# EAGLE design 6ch-dimmer (EAGLE 6.4)
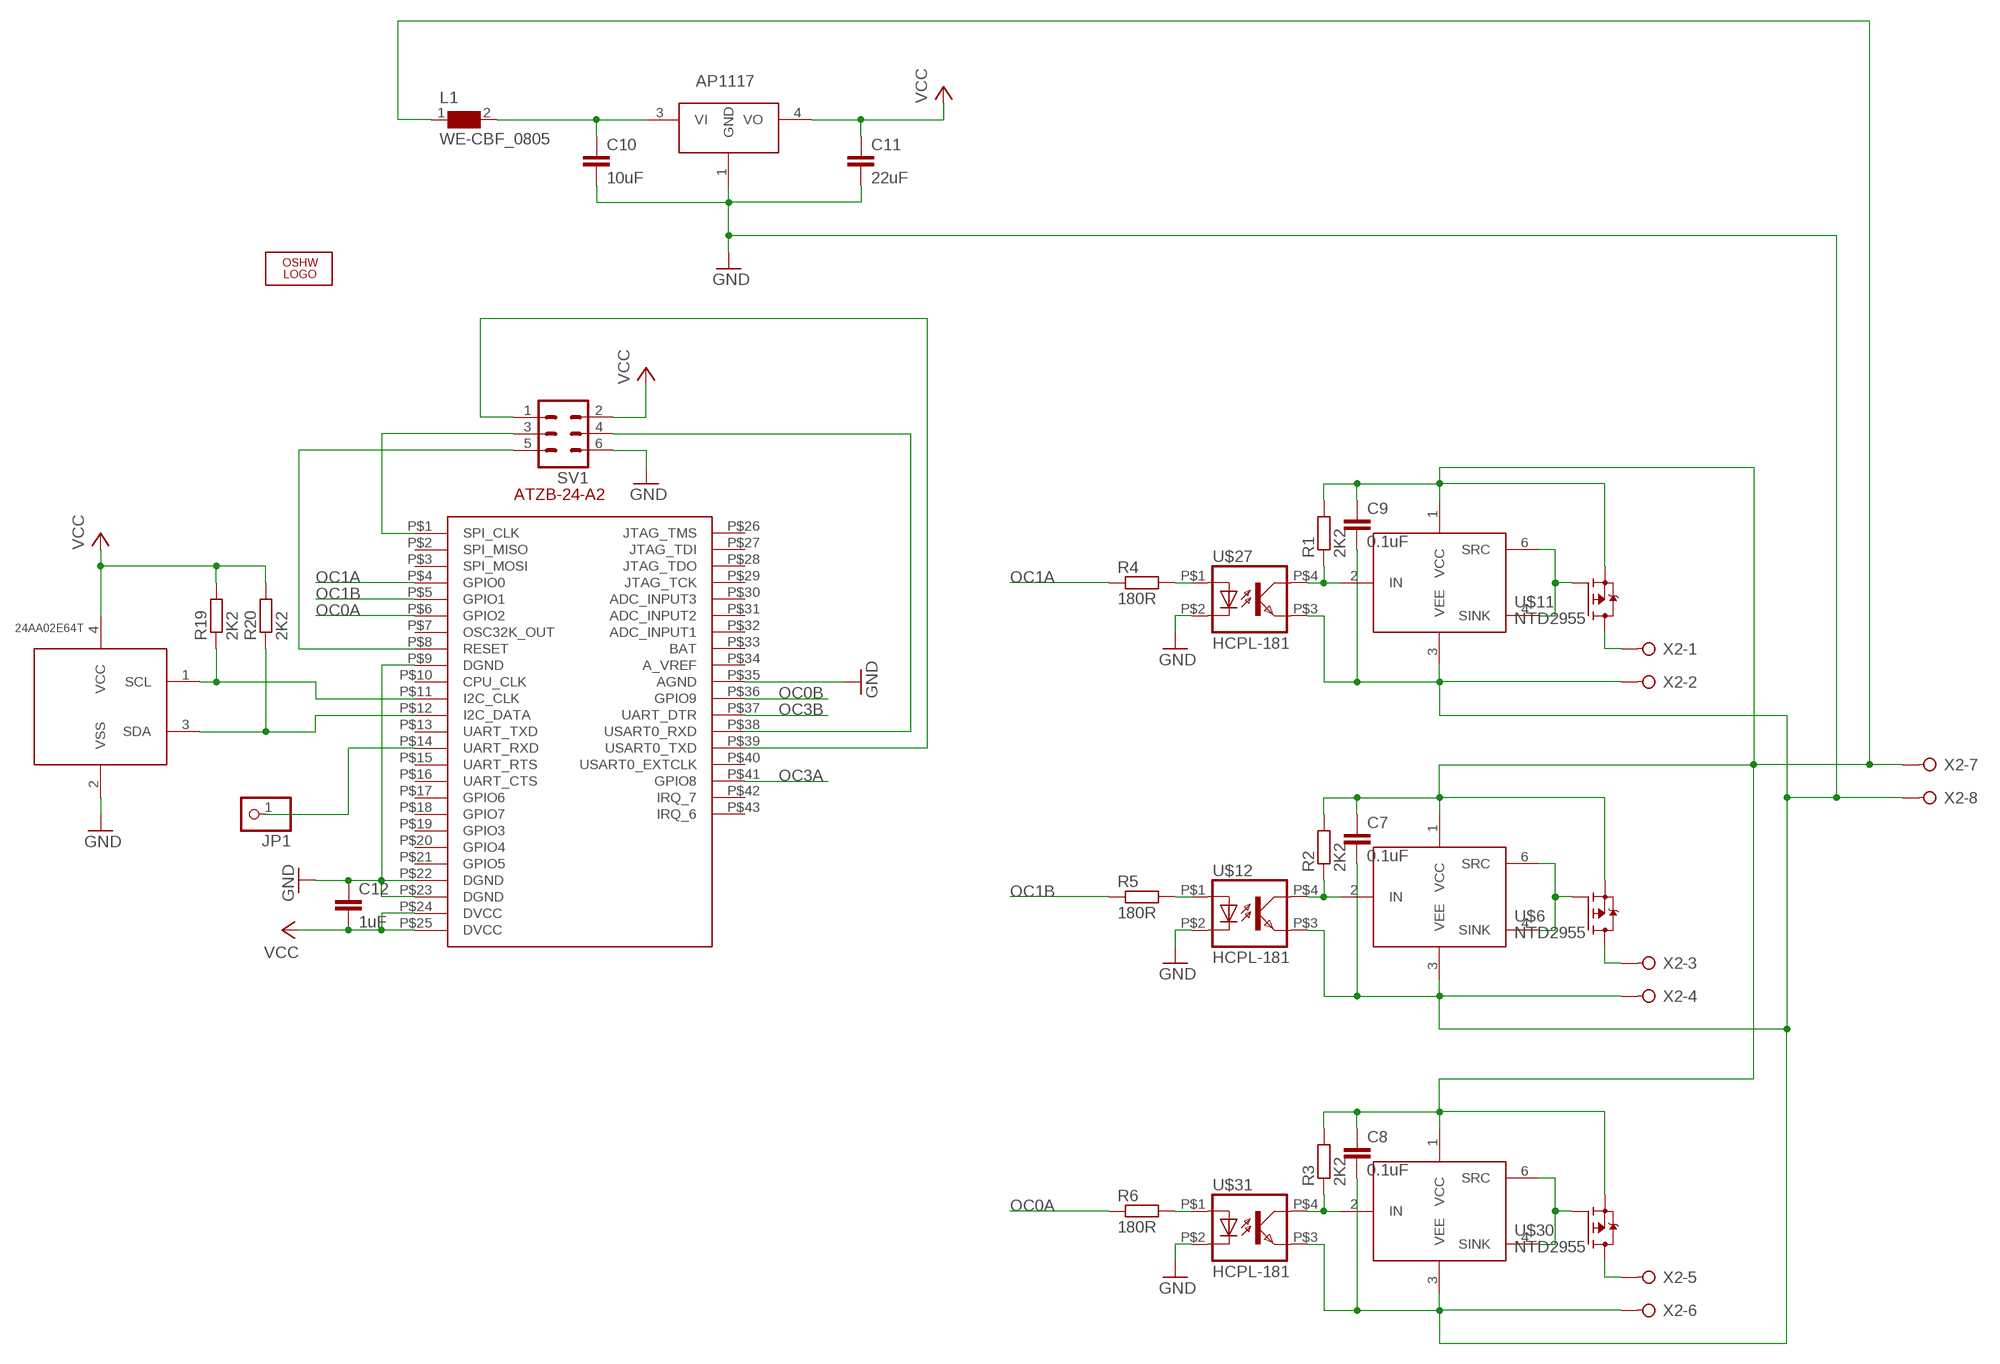
[diagram p0: schematic, sheet 1, part 1 of 2]
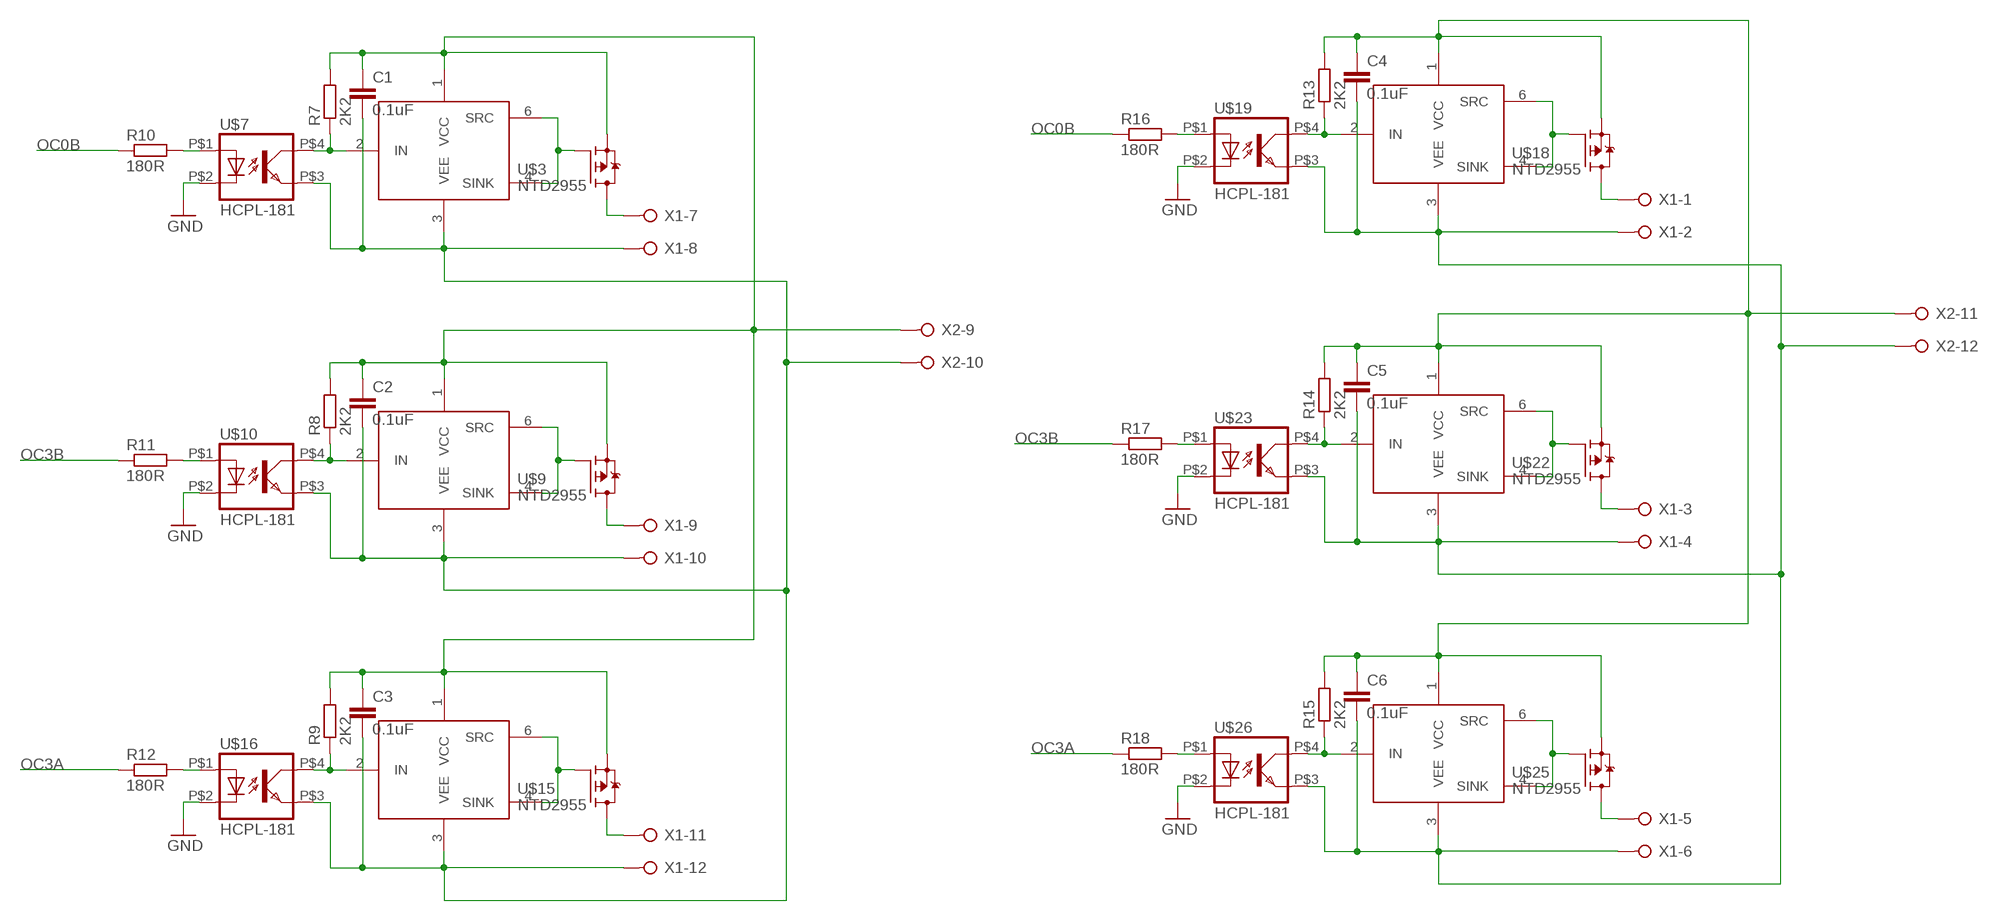
[diagram p1: schematic, sheet 1, part 2 of 2]

## Parts
C1  0.1uF  C-EUC0603  [C0603]
C2  0.1uF  C-EUC0603  [C0603]
C3  0.1uF  C-EUC0603  [C0603]
C4  0.1uF  C-EUC0603  [C0603]
C5  0.1uF  C-EUC0603  [C0603]
C6  0.1uF  C-EUC0603  [C0603]
C7  0.1uF  C-EUC0603  [C0603]
C8  0.1uF  C-EUC0603  [C0603]
C9  0.1uF  C-EUC0603  [C0603]
C10  10uF  C-EUC1210  [C1210]
C11  22uF  C-EUC1210  [C1210]
C12  1uF  C-EUC0603  [C0603]
JP1  PINHD-1X1  [1X01]
L1  WE-CBF_0805  [0805]
LOGO1  OSHW_LOGO_10MILX0500-NT  [OSHW_10X500_NOTEXT]
R1  2K2  R-EU_R0603  [R0603]
R2  2K2  R-EU_R0603  [R0603]
R3  2K2  R-EU_R0603  [R0603]
R4  180R  R-EU_R0603  [R0603]
R5  180R  R-EU_R0603  [R0603]
R6  180R  R-EU_R0603  [R0603]
R7  2K2  R-EU_R0603  [R0603]
R8  2K2  R-EU_R0603  [R0603]
R9  2K2  R-EU_R0603  [R0603]
R10  180R  R-EU_R0603  [R0603]
R11  180R  R-EU_R0603  [R0603]
R12  180R  R-EU_R0603  [R0603]
R13  2K2  R-EU_R0603  [R0603]
R14  2K2  R-EU_R0603  [R0603]
R15  2K2  R-EU_R0603  [R0603]
R16  180R  R-EU_R0603  [R0603]
R17  180R  R-EU_R0603  [R0603]
R18  180R  R-EU_R0603  [R0603]
R19  2K2  R-EU_R0603  [R0603]
R20  2K2  R-EU_R0603  [R0603]
SV1  MA03-2  [MA03-2]
U$1  ATZB-24-A2  [ATZB-24-A2]
U$2  ZXGD3005E6  [SOT23-6]
U$3  NTD2955  [DPAK]
U$4  ZXGD3005E6  [SOT23-6]
U$5  ZXGD3005E6  [SOT23-6]
U$6  NTD2955  [DPAK]
U$7  HCPL-181  [HCPL-181]
U$8  ZXGD3005E6  [SOT23-6]
U$9  NTD2955  [DPAK]
U$10  HCPL-181  [HCPL-181]
U$11  NTD2955  [DPAK]
U$12  HCPL-181  [HCPL-181]
U$13  ZXGD3005E6  [SOT23-6]
U$14  ZXGD3005E6  [SOT23-6]
U$15  NTD2955  [DPAK]
U$16  HCPL-181  [HCPL-181]
U$17  ZXGD3005E6  [SOT23-6]
U$18  NTD2955  [DPAK]
U$19  HCPL-181  [HCPL-181]
U$20  24AA02E64T  [SOT23-5L]
U$21  ZXGD3005E6  [SOT23-6]
U$22  NTD2955  [DPAK]
U$23  HCPL-181  [HCPL-181]
U$24  ZXGD3005E6  [SOT23-6]
U$25  NTD2955  [DPAK]
U$26  HCPL-181  [HCPL-181]
U$27  HCPL-181  [HCPL-181]
U$28  AP1117  [SOT223]
U$30  NTD2955  [DPAK]
U$31  HCPL-181  [HCPL-181]
X1  W237-12P  [W237-12P]
X2  W237-12P  [W237-12P]

## Nets
GND: C7.2 C8.2 C9.2 C10.2 C11.2 C12.1 SV1.6 U$1.P$9(DGND) U$1.P$22(DGND) U$1.P$23(DGND) U$1.P$35(AGND) U$4.3(VEE) U$5.3(VEE) U$7.P$2(C) U$10.P$2(C) U$12.P$2(C) U$12.P$3(EMIT) U$13.3(VEE) U$16.P$2(C) U$19.P$2(C) U$20.2(VSS) U$23.P$2(C) U$26.P$2(C) U$27.P$2(C) U$27.P$3(EMIT) U$28.1(GND) U$31.P$2(C) U$31.P$3(EMIT) X2.2 X2.4 X2.6 X2.8
N$1: U$2.4(SINK) U$2.6(SRC) U$3.1(G)
N$2: R7.1 U$2.2(IN) U$7.P$4(COL)
N$3: U$3.4(D) X1.7
N$4: U$4.4(SINK) U$4.6(SRC) U$11.1(G)
N$5: U$5.4(SINK) U$5.6(SRC) U$6.1(G)
N$6: R2.1 U$5.2(IN) U$12.P$4(COL)
N$7: U$8.4(SINK) U$8.6(SRC) U$9.1(G)
N$8: R8.1 U$8.2(IN) U$10.P$4(COL)
N$9: U$9.4(D) X1.9
N$10: U$14.4(SINK) U$14.6(SRC) U$15.1(G)
N$11: R9.1 U$14.2(IN) U$16.P$4(COL)
N$12: C1.1 C2.1 C3.1 R7.2 R8.2 R9.2 U$2.1(VCC) U$3.3(S) U$8.1(VCC) U$9.3(S) U$14.1(VCC) U$15.3(S) X2.9
N$13: R1.1 U$4.2(IN) U$27.P$4(COL)
N$14: U$11.4(D) X2.1
N$15: U$15.4(D) X1.11
N$16: R10.2 U$7.P$1(A)
N$17: R11.2 U$10.P$1(A)
N$18: R12.2 U$16.P$1(A)
N$20: JP1.1 U$1.P$14(UART_RXD)
N$22: U$6.4(D) X2.3
N$23: U$13.4(SINK) U$13.6(SRC) U$30.1(G)
N$24: R3.1 U$13.2(IN) U$31.P$4(COL)
N$25: C1.2 C2.2 C3.2 U$2.3(VEE) U$7.P$3(EMIT) U$8.3(VEE) U$10.P$3(EMIT) U$14.3(VEE) U$16.P$3(EMIT) X1.8 X1.10 X1.12 X2.10
N$26: C7.1 C8.1 C9.1 L1.1 R1.2 R2.2 R3.2 U$4.1(VCC) U$5.1(VCC) U$6.3(S) U$11.3(S) U$13.1(VCC) U$30.3(S) X2.7
N$27: U$17.4(SINK) U$17.6(SRC) U$18.1(G)
N$29: U$30.4(D) X2.5
N$30: R13.1 U$17.2(IN) U$19.P$4(COL)
N$31: U$18.4(D) X1.1
N$32: R4.2 U$27.P$1(A)
N$33: U$21.4(SINK) U$21.6(SRC) U$22.1(G)
N$34: R5.2 U$12.P$1(A)
N$35: R6.2 U$31.P$1(A)
N$36: R14.1 U$21.2(IN) U$23.P$4(COL)
N$37: U$22.4(D) X1.3
N$38: U$24.4(SINK) U$24.6(SRC) U$25.1(G)
N$39: R15.1 U$24.2(IN) U$26.P$4(COL)
N$40: C4.1 C5.1 C6.1 R13.2 R14.2 R15.2 U$17.1(VCC) U$18.3(S) U$21.1(VCC) U$22.3(S) U$24.1(VCC) U$25.3(S) X2.11
N$41: U$25.4(D) X1.5
N$42: R16.2 U$19.P$1(A)
N$43: R17.2 U$23.P$1(A)
N$44: R18.2 U$26.P$1(A)
N$45: C4.2 C5.2 C6.2 U$17.3(VEE) U$19.P$3(EMIT) U$21.3(VEE) U$23.P$3(EMIT) U$24.3(VEE) U$26.P$3(EMIT) X1.2 X1.4 X1.6 X2.12
N$51: R19.1 U$1.P$11(I2C_CLK) U$20.1(SCL)
N$52: R20.1 U$1.P$12(I2C_DATA) U$20.3(SDA)
N$53: C10.1 L1.2 U$28.3(VI)
N$54: SV1.1 U$1.P$39(USART0_TXD)
N$55: SV1.4 U$1.P$38(USART0_RXD)
N$56: SV1.3 U$1.P$1(SPI_CLK)
N$57: SV1.5 U$1.P$8(RESET)
OC0A: R6.1 U$1.P$6(GPIO2)
OC0B: R10.1 R16.1 U$1.P$36(GPIO9)
OC1A: R4.1 U$1.P$4(GPIO0)
OC1B: R5.1 U$1.P$5(GPIO1)
OC3A: R12.1 R18.1 U$1.P$41(GPIO8)
OC3B: R11.1 R17.1 U$1.P$37(UART_DTR)
VCC: C11.1 C12.2 R19.2 R20.2 SV1.2 U$1.P$24(DVCC) U$1.P$25(DVCC) U$20.4(VCC) U$28.4(VO)
Unconnected: U$1.P$2(SPI_MISO) U$1.P$3(SPI_MOSI) U$1.P$7(OSC32K_OUT) U$1.P$10(CPU_CLK) U$1.P$13(UART_TXD) U$1.P$15(UART_RTS) U$1.P$16(UART_CTS) U$1.P$17(GPIO6) U$1.P$18(GPIO7) U$1.P$19(GPIO3) U$1.P$20(GPIO4) U$1.P$21(GPIO5) U$1.P$26(JTAG_TMS) U$1.P$27(JTAG_TDI) U$1.P$28(JTAG_TDO) U$1.P$29(JTAG_TCK) U$1.P$30(ADC_INPUT3) U$1.P$31(ADC_INPUT2) U$1.P$32(ADC_INPUT1) U$1.P$33(BAT) U$1.P$34(A_VREF) U$1.P$40(USART0_EXTCLK) U$1.P$42(IRQ_7) U$1.P$43(IRQ_6)

## Library data of the parts
C1-C12 = resistor:C-EU: CAPACITOR, European symbol
JP1 = pinhead:PINHD-1X1: PIN HEADER
L1 = EagleLibrary_Wuerth_Elektronik_eiSos_Version_6:WE-CBF: SMD EMI Suppression Ferrite Beads WE-CBF - Excellent anti-EMI properties - Low DC-restistance - Impedances till 3000 ohms - Rated current up to 6 A -- Reliable Ni-Sn electrodes -- Perfect as data lined filter and for uncoupling of distribution voltage
LOGO1 = ohw-logo:OSHW_LOGO_10MIL
R1-R20 = resistor:R-EU_: RESISTOR, European symbol
SV1 = con-lstb:MA03-2: PIN HEADER; OC_FARNELL: unknown; OC_NEWARK: unknown
U$1 = __SR:ATZB-24-A2
U$2 U$4 U$5 U$8 U$13 U$14 U$17 U$21 U$24 = __SR:ZXGD3005E6
U$3 U$6 U$9 U$11 U$15 U$18 U$22 U$25 U$30 = __SR:NTD2955
U$7 U$10 U$12 U$16 U$19 U$23 U$26 U$27 U$31 = __SR:HCPL-181
U$20 = __SR:24AA02E64T
U$28 = __SR:AP1117
X1 X2 = con-wago-508:W237-12P: WAGO SREW CLAMP; OC_FARNELL: unknown; OC_NEWARK: unknown

## Board
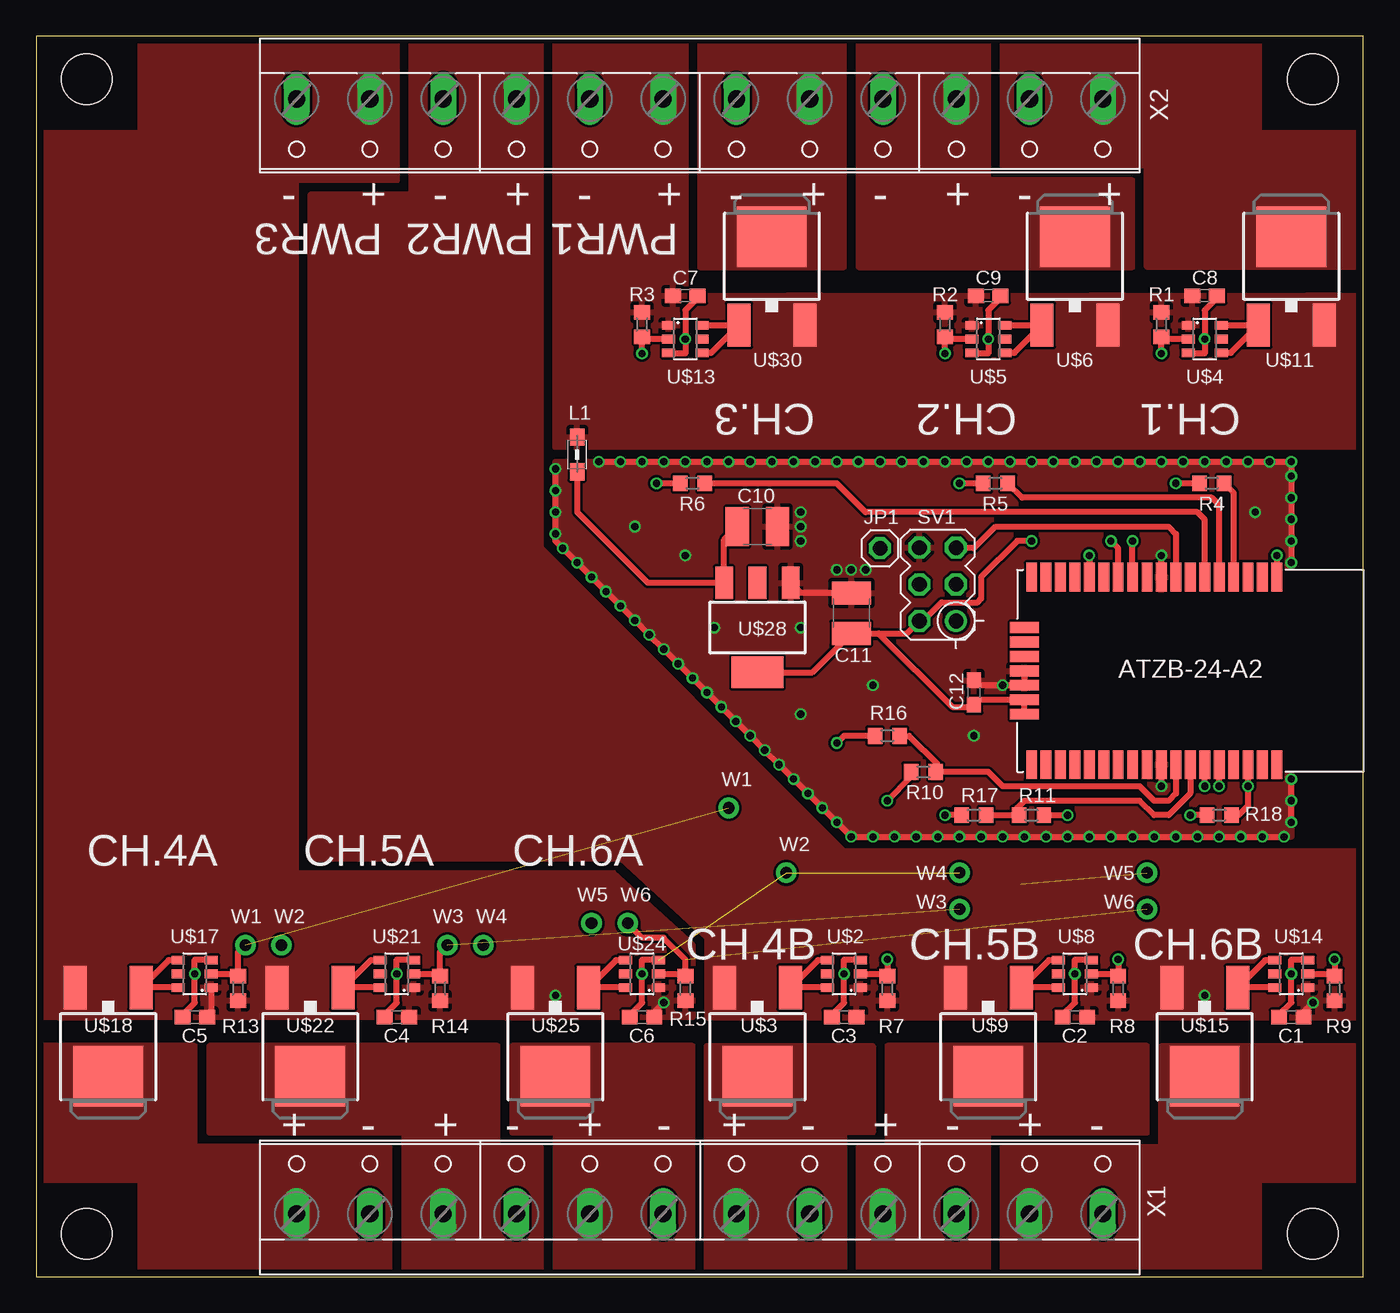
[diagram p2: board, top side]
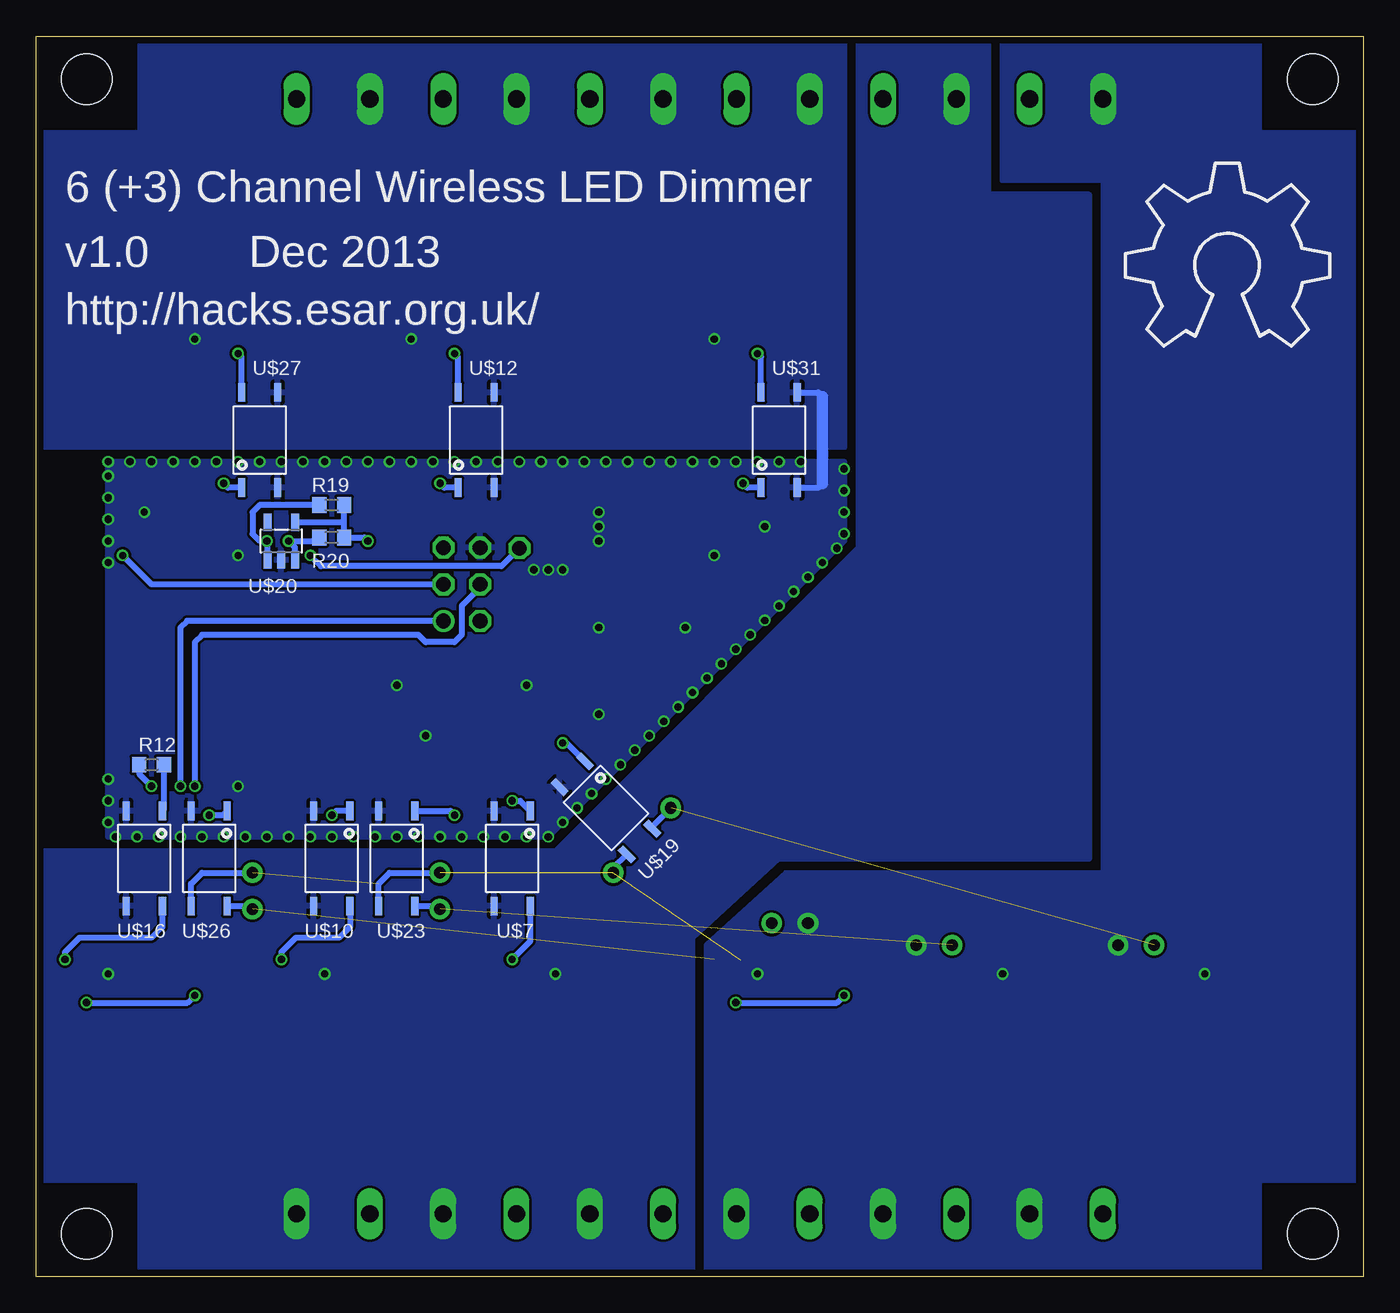
[diagram p3: board, bottom side, seen from below]

Size 92 x 86 mm. Coordinates in mm from the lower left corner, seen from the top.
Outline: 0,0 92,0 92,86 0,86 0,0
Copper layers (1*16): Top 0.035mm / dielectric 1.5mm / Bottom 0.035mm
Design rules "EagleRules *": minimum track width 7mil, minimum drill 12mil, track to track 7mil, track to pad 7mil, pad to pad 7mil, via to via 7mil, smd to smd 0mil, copper to edge 20mil, drill to drill 10mil, minimum pad ring 10mil, minimum via ring 6mil, stop-mask expansion 2mil, vias tented up to drill 25mil, thermal gap 10mil
Holes 3.5 mm at 3.5,83 88.5,83 88.5,3 3.5,3
tRestrict: area 0,79.5 to 7,86; area 85,79.5 to 92,86; area 0,0 to 7,6.5; area 85,0 to 92,6.5
bRestrict: area 0,79.5 to 7,86; area 85,79.5 to 92,86; area 0,0 to 7,6.5; area 85,0 to 92,6.5

### Footprints (pad centres in the part's own frame; a part is rotated, then mirrored left to right if it is on the bottom)
C0603 = smd 1.1 x 1: 1 -0.85,0; 2 0.85,0
C1210 = smd 1.6 x 2.7: 1 -1.4,0; 2 1.4,0
1X01 = drill 1.016 octagon: 1 0,0
0805 = smd 1.2 x 1: 1 -1.2,0; 2 1.2,0
R0603 = smd 1 x 1.1: 1 -0.85,0; 2 0.85,0
MA03-2 = drill 1.016: 1 -2.54,-1.27 | drill 1.016 octagon: 2 -2.54,1.27; 3 0,-1.27; 4 0,1.27; 5 2.54,-1.27; 6 2.54,1.27
ATZB-24-A2 = smd 0.75 x 2: P$1 6,6.5; P$2 5,6.5; P$3 4,6.5; P$4 3,6.5; P$5 2,6.5; P$6 1,6.5; P$7 0,6.5; P$8 -1,6.5; P$9 -2,6.5; P$10 -3,6.5; P$11 -4,6.5; P$12 -5,6.5; P$13 -6,6.5; P$14 -7,6.5; P$15 -8,6.5; P$16 -9,6.5; P$17 -10,6.5; P$18 -11,6.5; P$26 -11,-6.5; P$27 -10,-6.5; P$28 -9,-6.5; P$29 -8,-6.5; P$30 -7,-6.5; P$31 -6,-6.5; P$32 -5,-6.5; P$33 -4,-6.5; P$34 -3,-6.5; P$35 -2,-6.5; P$36 -1,-6.5; P$37 0,-6.5; P$38 1,-6.5; P$39 2,-6.5; P$40 3,-6.5; P$41 4,-6.5; P$42 5,-6.5; P$43 6,-6.5 | smd 2 x 0.75: P$19 -11.5,3; P$20 -11.5,2; P$21 -11.5,1; P$22 -11.5,0; P$23 -11.5,-1; P$24 -11.5,-2; P$25 -11.5,-3
SOT23-6 = smd 0.6 x 0.9: 1 -0.95,-1.15; 2 0,-1.15; 3 0.95,-1.15; 4 0.95,1.15; 5 0,1.15; 6 -0.95,1.15
DPAK = smd 1.6 x 3: 1 -2.28,-4.04; 3 2.28,-4.04 | smd 4.826 x 4.191: 4 0,2.096
HCPL-181 = smd 1.3 x 0.5: P$1 -3.3,1.252; P$2 -3.3,-1.252; P$3 3.3,-1.252; P$4 3.3,1.252
SOT23-5L = smd 0.55 x 1.2: 1 -0.95,-1.3; 2 0,-1.3; 3 0.95,-1.3; 4 0.95,1.3; 5 -0.95,1.3
SOT223 = smd 1.219 x 2.235: 1 -2.311,-3.099; 2 0,-3.099; 3 2.311,-3.099 | smd 3.6 x 2.2: 4 0,3.099
W237-12P = drill 1.194 long: 1 -27.94,-0.635; 2 -22.86,-0.635; 3 -17.78,-0.635; 4 -12.7,-0.635; 5 -7.62,-0.635; 6 -2.54,-0.635; 7 2.54,-0.635; 8 7.62,-0.635; 9 12.7,-0.635; 10 17.78,-0.635; 11 22.86,-0.635; 12 27.94,-0.635

### Placement (x,y rotation side)
C1  87,18 180 top
C2  72,18 180 top
C3  56,18 180 top
C4  25,18 180 top
C5  11,18 180 top
C6  42,18 180 top
C7  45,68 0 top
C8  81,68 0 top
C9  66,68 0 top
C10  50,52 0 top
C11  56.5,46 90 top
C12  65,40.5 270 top
JP1  58.5,50.5 180 top
L1  37.5,57 270 top
LOGO1  16.5,64.5 0 bottom
R1  78,66 90 top
R2  63,66 90 top
R3  42,66 90 top
R4  81.5,55 180 top
R5  66.5,55 180 top
R6  45.5,55 180 top
R7  59,20 270 top
R8  75,20 270 top
R9  90,20 270 top
R10  61.5,35 180 top
R11  69,32 0 top
R12  84,35.5 0 bottom
R13  14,20 270 top
R14  28,20 270 top
R15  45,20 270 top
R16  59,37.5 180 top
R17  65,32 180 top
R18  82,32 180 top
R19  71.5,53.5 0 bottom
R20  71.5,51.25 0 bottom
SV1  62.5,48 90 top
U$1  80,42 0 top
U$2  56,21 90 top
U$3  50,16 180 top
U$4  81,65 270 top
U$5  66,65 270 top
U$6  72,70 0 top
U$7  59,29 270 bottom
U$8  72,21 90 top
U$9  66,16 180 top
U$10  71.5,29 270 bottom
U$11  87,70 0 top
U$12  61.5,58 90 bottom
U$13  45,65 270 top
U$14  87,21 90 top
U$15  81,16 180 top
U$16  84.5,29 270 bottom
U$17  11,21 90 top
U$18  5,16 180 top
U$19  52.5,32.5 315 bottom
U$20  75,51 0 bottom
U$21  25,21 90 top
U$22  19,16 180 top
U$23  67,29 270 bottom
U$24  42,21 90 top
U$25  36,16 180 top
U$26  80,29 270 bottom
U$27  76.5,58 90 bottom
U$28  50,45 180 top
U$30  51,70 0 top
U$31  40.5,58 90 bottom
X1  46,5 0 top
X2  46,81 180 top

### Tracks (layer width: path | path; a pad name or v marks a point on that pad's centre or on a via)
GND  (via drill 0.5)
  Top 0.406: U$1.P$22 U$1.P$23 v67,41 65.35,41 C12.1 | U$1.P$9 v78,50 | U$1.P$35 v78,34 | v86.5,30.5 v85,30.5 v83.5,30.5 v82,30.5 v80.5,30.5 v79,30.5 v77.5,30.5 v76,30.5 v74.5,30.5 v73,30.5 v71.5,30.5 v70,30.5 v68.5,30.5 v67,30.5 v65.5,30.5 v64,30.5 v62.5,30.5 v61,30.5 v59.5,30.5 v58,30.5 v56.5,30.5 v55.5,31.5 v54.5,32.5 v53.5,33.5 v52.5,34.5 v51.5,35.5 v50.5,36.5 v49.5,37.5 v48.5,38.5 v47.5,39.5 v46.5,40.5 v45.5,41.5 v44.5,42.5 v43.5,43.5 v42.5,44.5 v41.5,45.5 v40.5,46.5 v39.5,47.5 v38.5,48.5 v37.5,49.5 v36.5,50.5 36,51 v36,51.5 v36,53 v36,54.5 v36,56 | v87,31.5 v87,33 v87,34.5 | v39,56.5 v40.5,56.5 v42,56.5 v43.5,56.5 v45,56.5 v46.5,56.5 v48,56.5 v49.5,56.5 v51,56.5 v52.5,56.5 v54,56.5 v55.5,56.5 v57,56.5 v58.5,56.5 v60,56.5 v61.5,56.5 v63,56.5 v64.5,56.5 v66,56.5 v67.5,56.5 v69,56.5 v70.5,56.5 v72,56.5 v73.5,56.5 v75,56.5 v76.5,56.5 v78,56.5 v79.5,56.5 v81,56.5 v82.5,56.5 v84,56.5 v85.5,56.5 v87,56.5 v87,55.5 v87,54 v87,52.5 v87,51 v87,49.5 | C11.2 53.01,47.4 U$28.1 | C8.2 81.85,67.85 81,67 v81,65 81,64 79.9,64 U$4.3 | C9.2 66.85,67.85 66,67 v66,65 66,64 64.9,64 U$5.3 | C7.2 45.85,67.85 45,67 v45,65 45,64 43.9,64 U$13.3
  Bottom 0.406: U$31.P$2 37.8,54.7 37.5,55 | U$31.P$3 37.8,61.3 37.5,61
  Bottom 0.813: 37.5,55 37.5,61
  other vias: 53,53 53,52 53,51 55.5,49 56.5,49 57.5,49 41.5,52 45,50 47,45 53,45 53,39 58,41 65,37.5 84.5,53
  pour Bottom: 87,56.5 36,56.5 36,51 56.5,30.5 87,30.5
  pour Top: 36,56.5 87,56.5 87,30.5 56.5,30.5 36,51
  pour Bottom: 92,86 36,86 36,57.5 92,57.5
  pour Bottom (no thermals): 37,84 37,79.5 39.5,79.5 39.5,84
  pour Bottom (no thermals): 47.5,83.5 47.5,79.5 49.5,79.5 49.5,83.5
  pour Bottom (no thermals): 57.5,84 57.5,79.5 60,79.5 60,84
  pour Bottom (no thermals): 67.5,84 67.5,79.5 70,79.5 70,84
N$1
  Top 0.406: U$2.6 U$3.1 54.19,21.95 U$2.4
N$2  (via drill 0.5)
  Top 0.406: U$2.2 58.85,21 R7.1 v59,22
  Bottom 0.406: U$7.P$4 57.75,23.25 v59,22
N$3
  pour Top (no thermals): 46.5,16 58,16 58,10 56,10 56,0 46.5,0
N$4
  Top 0.406: U$4.6 U$11.1 82.81,64.05 U$4.4
N$5
  Top 0.406: U$5.6 U$6.1 67.81,64.05 U$5.4
N$6  (via drill 0.5)
  Top 0.406: U$5.2 63.15,65 R2.1 v63,64
  Bottom 0.406: U$12.P$4 62.75,63.75 v63,64
N$7
  Top 0.406: U$8.6 U$9.1 70.19,21.95 U$8.4
N$8  (via drill 0.5)
  Top 0.406: U$8.2 74.85,21 R8.1 v75,22
  Bottom 0.406: v75,22 75,22.5 74,23.5 71,23.5 70.25,24.25 U$10.P$4
N$9
  pour Top (no thermals): 66,0 66,10 77,10 77,16 59,16 59,9 57,9 57,0 65,0
N$10
  Top 0.406: U$14.6 U$15.1 85.19,21.95 U$14.4
N$11  (via drill 0.5)
  Top 0.406: U$14.2 89.85,21 R9.1 v90,22
  Bottom 0.406: U$16.P$4 83.25,24.25 84,23.5 89,23.5 90,22.5 v90,22
N$12  (via drill 0.5)
  Top 0.406: C1.1 87.85,18.35 v88.5,19
  Bottom 0.406: v88.5,19 81.5,19 v81,19.5
  pour Top: 26,86 26,75 19,75 19,29 40.5,29 46.5,23.5 46.5,18 92,18 92,29.5 56,29.5 35,50.5 35,86
  pour Top (no thermals): 32,84 32,79.5 34.5,79.5 34.5,84
  pour Top (no thermals): 46.5,22 46.5,18 49,18 49,22
  pour Top (no thermals): 62.5,22 65,22 65,18 62.5,18
  pour Top (no thermals): 77.5,22 80,22 80,18 77.5,18
N$13  (via drill 0.5)
  Top 0.406: U$4.2 78.15,65 R1.1 v78,64
  Bottom 0.406: U$27.P$4 77.75,63.75 v78,64
N$14
  pour Top (no thermals): 67,86 92,86 92,70 77,70 77,77 67,77
N$15
  pour Top (no thermals): 78,16 92,16 92,15 92,0 67,0 67,9 78,9
N$16  (via drill 0.5)
  Top 0.406: R10.2 60.65,34.65 v59,33
  Bottom 0.406: v59,33 58.45,33 U$7.P$1
N$17  (via drill 0.5)
  Top 0.406: R11.2 v71.5,32
  Bottom 0.406: U$10.P$1 71.2,32.3 v71.5,32
N$18
  Bottom 0.406: R12.2 83.15,32.4 U$16.P$1
N$20  (via drill 0.5)
  Top 0.406: v73,50 U$1.P$14
  Bottom 0.406: JP1.1 59.75,49.25 72.25,49.25 v73,50
N$22
  pour Top (no thermals): 76,70 76,76 66,76 66,86 57,86 57,70
N$23
  Top 0.406: U$13.6 U$30.1 46.81,64.05 U$13.4
N$24  (via drill 0.5)
  Top 0.406: U$13.2 42.15,65 R3.1 v42,64
  Bottom 0.406: U$31.P$4 41.75,63.75 v42,64
N$25  (via drill 0.5)
  Top 0.406: C3.2 55.15,18.15 56,19 v56,21 56,22 57.1,22 U$2.3 | C2.2 71.15,18.15 72,19 v72,21 72,22 73.1,22 U$8.3 | C1.2 86.15,18.15 87,19 v87,21 87,22 88.1,22 U$14.3
  pour Bottom: 46.5,0 46.5,23.5 40.5,29 19,29 19,75 26,75 26,86 35,86 35,50.5 56,29.5 92,29.5 92,0
  pour Bottom (no thermals): 27,84 27,79.5 29.5,79.5 29.5,84
  pour Bottom (no thermals): 52.5,6.5 55,6.5 55,2 52.5,2
  pour Bottom (no thermals): 62.5,6.5 65,6.5 65,2 62.5,2
  pour Bottom (no thermals): 72.5,6.5 75.5,6.5 75.5,2 72.5,2
N$26
  pour Top: 45,86 45,68 92,68 92,57.5 36,57.5 36,86
  pour Top (no thermals): 52,68 52,64 54.5,64 54.5,68
  pour Top (no thermals): 73,68 73,64 75.5,64 75.5,68
  pour Top (no thermals): 88,68 88,64 90.5,64 90.5,68
  pour Top (no thermals): 42,84 42,79.5 44.5,79.5 44.5,84
N$27
  Top 0.406: U$17.6 U$18.1 9.19,21.95 U$17.4
N$29
  pour Top (no thermals): 56,70 56,86 46,86 46,70
N$30  (via drill 0.8 pad 1.42)  (1 unrouted)
  Top 0.406: U$17.2 13.85,21 R13.1 14,22.5 v14.5,23
  Bottom 0.406: U$19.P$4 49.28,31.22 v48,32.5
N$31
  pour Top (no thermals): 11,16 0,16 0,0 24.5,0 24.5,9 11,9
N$32  (via drill 0.5)
  Top 0.406: R4.2 v79,55
  Bottom 0.406: U$27.P$1 78.7,54.7 v79,55
N$33
  Top 0.406: U$21.6 U$22.1 23.19,21.95 U$21.4
N$34  (via drill 0.5)
  Top 0.406: R5.2 v64,55
  Bottom 0.406: U$12.P$1 63.7,54.7 v64,55
N$35  (via drill 0.5)
  Top 0.406: R6.2 v43,55
  Bottom 0.406: U$31.P$1 42.7,54.7 v43,55
N$36  (via drill 0.8 pad 1.42)  (1 unrouted)
  Top 0.406: U$21.2 27.85,21 R14.1 28,22.5 v28.5,23
  Bottom 0.406: U$23.P$4 64.2,25.7 v64,25.5
N$37
  pour Top (no thermals): 12,16 12,10 25.5,10 25.5,0 35,0 35,9 32,9 32,16
N$38
  Top 0.406: U$24.6 U$25.1 40.19,21.95 U$24.4
N$39  (via drill 0.8 pad 1.42)  (1 unrouted)
  Top 0.406: U$24.2 44.85,21 R15.1 45,22 43.5,23.5 42,23.5 v41,24.5
  Bottom 0.406: U$26.P$4 77.2,25.7 v77,25.5
N$40  (via drill 0.5)
  Top 0.406: U$17.1 12.15,18.3 C5.1 | C6.1 42.85,18.35 v43.5,19
  Bottom 0.406: v43.5,19 36.5,19 v36,19.5
  pour Top: 25,86 25,76 18,76 18,28 40,28 45.5,23 45.5,18 0,18 0,86
  pour Top (no thermals): 21.5,84 21.5,79.5 24.5,79.5 24.5,84
  pour Top (no thermals): 1.5,22 1.5,18 4,18 4,22
  pour Top (no thermals): 15.5,22 18,22 18,18 15.5,18
  pour Top (no thermals): 32.5,22 32.5,18 35,18 35,22
N$41
  pour Top (no thermals): 33,16 33,10 36,10 36,0 45.5,0 45.5,16
N$42  (via drill 0.5)
  Top 0.406: R16.2 56,37.5 v55.5,37
  Bottom 0.406: v55.5,37 55.23,37 U$19.P$1
N$43  (via drill 0.5)
  Top 0.406: R17.2 v63,32
  Bottom 0.406: U$23.P$1 63.3,32.3 v63,32
N$44  (via drill 0.5)
  Top 0.406: R18.2 v80,32
  Bottom 0.406: v80,32 79.05,32 U$26.P$1
N$45  (via drill 0.5, 0.8 pad 1.42)  (3 unrouted)
  Top 0.406: C5.2 10.15,18.15 11,19 v11,21 11,22 12.1,22 U$17.3 | C4.2 24.15,18.15 25,19 v25,21 25,22 26.1,22 U$21.3 | C6.2 41.15,18.15 42,19 v42,21 42,22 43.1,22 U$24.3
  Bottom 0.406: v52,28 52,28.33 U$19.P$3 | U$23.P$3 68.25,27.25 67.5,28 v64,28 | U$26.P$3 81.25,27.25 80.5,28 v77,28
  other vias: 17,23 31,23 38.5,24.5
  pour Bottom: 0,0 45.5,0 45.5,23 40,28 18,28 18,76 25,76 25,86 0,86
  pour Bottom (no thermals): 16.5,84 19.5,84 19.5,79.5 16.5,79.5
  pour Bottom (no thermals): 21.5,6.5 24.5,6.5 24.5,2 21.5,2
  pour Bottom (no thermals): 32,6.5 34.5,6.5 34.5,2 32,2
  pour Bottom (no thermals): 42,6.5 45,6.5 45,2 42,2
N$51  (via drill 0.5)
  Top 0.406: U$1.P$11 v76,51
  Bottom 0.406: U$20.1 75.95,50.95 v76,51 76.5,51 77,51.5 77,53 76.5,53.5 R19.1
N$52  (via drill 0.5)
  Top 0.406: U$1.P$12 75,50.5 v74.5,51
  Bottom 0.406: U$20.3 74.05,50.55 v74.5,51 72.6,51 R20.1
N$53
  Top 0.406: L1.2 37.5,53 42.4,48.1 U$28.3 47.69,51.09 C10.1
N$54  (via drill 0.5)
  Top 0.406: v82,34 U$1.P$39
  Bottom 0.406: SV1.1 81.54,45.46 82,45 v82,34
N$55  (via drill 0.5)
  Top 0.406: v81,34 U$1.P$38
  Bottom 0.406: SV1.4 61.23,47.77 62.5,46.5 62.5,44.5 63,44 65,44 65.5,44.5 80.5,44.5 81,44 v81,34
N$56  (via drill 0.5)
  Top 0.406: v86,50 U$1.P$1
  Bottom 0.406: SV1.3 84,48 v86,50
N$57
  Top 0.406: U$1.P$8 79,51.5 78.5,52 66.5,52 65,50.5 63.81,50.5 SV1.5
OC0A
  Top 0.406: U$1.P$6 81,52.5 80.5,53 57.5,53 55.5,55 R6.1
OC0B
  Top 0.406: U$1.P$36 79,33.5 78.5,33 77.5,33 76.5,34 67,34 66,35 R10.1 62.5,35.15 62.5,35.5 60.5,37.5 R16.1
OC1A
  Top 0.406: U$1.P$4 83,54.35 R4.1
OC1B
  Top 0.406: U$1.P$5 82,53.5 81.5,54 68.35,54 R5.1
OC3A  (via drill 0.5)
  Top 0.406: U$1.P$41 v84,34 84,32.65 83.35,32 R18.1
  Bottom 0.406: R12.1 84.85,34.85 v84,34
OC3B
  Top 0.406: U$1.P$37 80,33.5 78.5,32 77.5,32 76.5,33 68.5,33 68,32.5 68,32.15 R11.1 R17.1
VCC  (via drill 0.5)
  Top 0.406: 58.4,44.6 C11.1 53.8,41.9 U$28.4 | 58.4,44.6 63.5,39.5 64.85,39.5 C12.2 65.35,40 U$1.P$24 U$1.P$25 | 58.4,44.6 60.37,44.6 SV1.2 61.46,45.46 62.75,46.75 65.25,46.75 65.5,47 65.5,48.5 68,51 v69,51
  Bottom 0.406: v69,51 69.25,51.25 R20.2 70.65,52.3 | R19.2 70.65,52.5 70.65,52.3 | U$20.4 70.65,52.3

### Text on the board
tPlace: - | + | - | + | - | + | - | + | - | + | - | + | PWR3 | PWR2 | PWR1 | CH.3 | CH.2 | CH.1 | ATZB-24-A2 | W1 | W2 | CH.4A | CH.5A | CH.6A | W4 | W5 | W5 | W6 | W3 | W6 | W1 | W2 | W3 | W4 | CH.4B | CH.5B | CH.6B | + | - | + | - | + | - | + | - | + | - | + | -
bPlace: 6 (+3) Channel Wireless LED Dimmer | Dec 2013 | v1.0 | http://hacks.esar.org.uk/